# Altium schematic sheet Top.SchDoc
size 431 x 279 mm; Author: Shivam Sharma; SheetNumber: 1; SheetTotal: 14; SheetRevision: 1.0
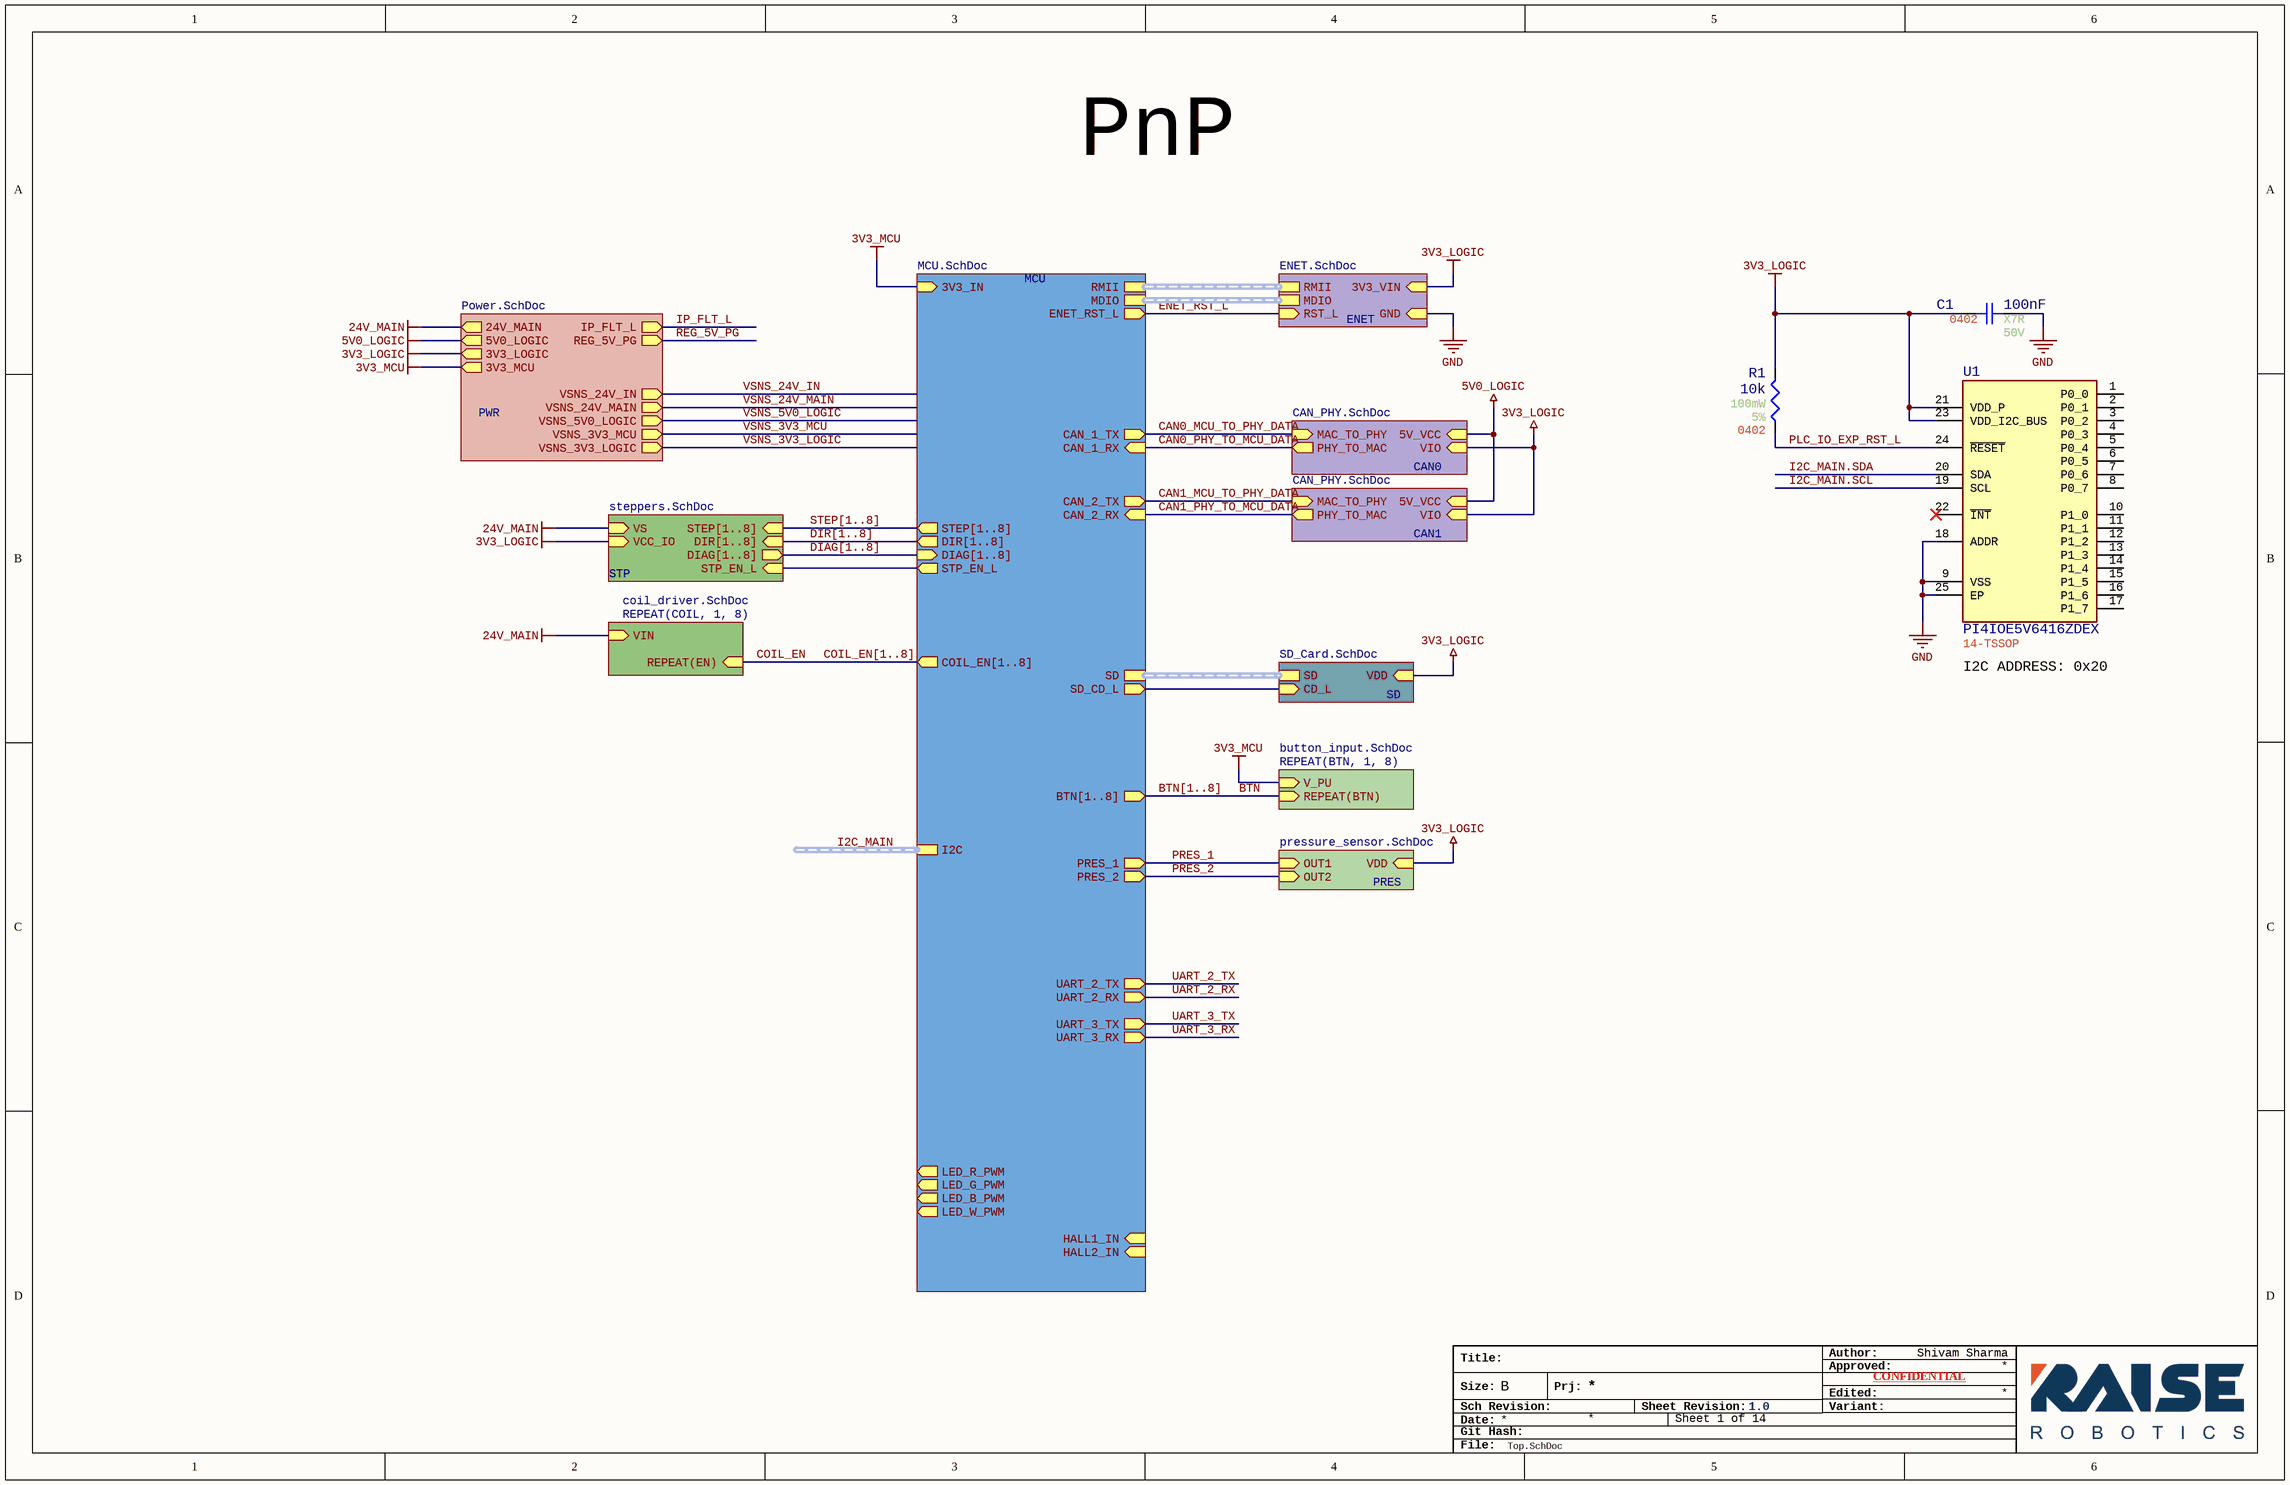
[diagram p0: Top.SchDoc]

## Parts
C1  value 100nF  Temperature Coefficient: X7R  Voltage Rating: 50V  Case/Package: 0402  [Generic 0402 capacitor]  (hidden comment: GRT155R71H104KE01D)
R1  value 10k  Power: 100mW  Tolerance: 5%  Case/Package: 0402  [Generic 0402 Resistor]  (hidden comment: ERJ-2GEJ103X)
U1  PI4IOE5V6416ZDEX  Case/Package: 14-TSSOP  [PI4IOE5V6416ZDEX]

## Sub-sheets
CAN0 = CAN_PHY.SchDoc: 5V_VCC (in), VIO (in), MAC_TO_PHY (in), PHY_TO_MAC (out)
CAN1 = CAN_PHY.SchDoc: 5V_VCC (in), VIO (in), MAC_TO_PHY (in), PHY_TO_MAC (out)
ENET = ENET.SchDoc: 3V3_VIN (in), GND (in), MDIO (harness MDIO), RMII (harness RMII), RST_L (in)
MCU = MCU.SchDoc: RMII (harness RMII), CAN_1_RX (in), CAN_1_TX (out), 3V3_IN (in), SD (harness SD), LED_R_PWM (out), LED_G_PWM (out), LED_B_PWM (out), LED_W_PWM (out), HALL2_IN (in), HALL1_IN (in), MDIO (harness MDIO), ENET_RST_L (out), SD_CD_L (out), UART_2_TX (out), UART_2_RX (out), UART_3_TX (out), UART_3_RX (out), CAN_2_RX (in), CAN_2_TX (out), STEP[1..8] (out), DIR[1..8] (out), DIAG[1..8] (in), STP_EN_L (out), I2C (harness I2C), COIL_EN[1..8] (out), BTN[1..8] (out), PRES_1 (out), PRES_2 (out)
PRES = pressure_sensor.SchDoc: VDD (in), OUT1 (in), OUT2 (in)
PWR = Power.SchDoc: IP_FLT_L (out), 24V_MAIN (out), 3V3_MCU (out), 3V3_LOGIC (out), 5V0_LOGIC (out), REG_5V_PG (out), VSNS_24V_IN (out), VSNS_24V_MAIN (out), VSNS_5V0_LOGIC (out), VSNS_3V3_MCU (out), VSNS_3V3_LOGIC (out)
REPEAT(BTN, 1, 8) = button_input.SchDoc: V_PU (in), REPEAT(BTN) (in)
REPEAT(COIL, 1, 8) = coil_driver.SchDoc: VIN (in), REPEAT(EN) (in)
SD = SD_Card.SchDoc: SD (harness SD), VDD (in), CD_L (in)
STP = steppers.SchDoc: STP_EN_L (in), DIAG[1..8] (out), VS (in), VCC_IO (in), STEP[1..8] (in), DIR[1..8] (in)

## Nets
3V3_LOGIC: C1.2 R1.2 U1.21(VDD_P) U1.23(VDD_I2C_BUS) ; sheet PWR/3V3_LOGIC, sheet CAN0/VIO, sheet CAN1/VIO, sheet ENET/3V3_VIN, sheet SD/VDD, sheet STP/VCC_IO, sheet PRES/VDD
3V3_MCU: sheet MCU/3V3_IN, sheet PWR/3V3_MCU, sheet REPEAT(BTN, 1, 8)/V_PU
5V0_LOGIC: sheet PWR/5V0_LOGIC, sheet CAN0/5V_VCC, sheet CAN1/5V_VCC
24V_MAIN: sheet PWR/24V_MAIN, sheet STP/VS, sheet REPEAT(COIL, 1, 8)/VIN
GND: C1.1 U1.9(VSS) U1.18(ADDR) U1.25(EP) ; sheet ENET/GND
BTN: sheet REPEAT(BTN, 1, 8)/REPEAT(BTN)
CAN0_MCU_TO_PHY_DATA: sheet MCU/CAN_1_TX, sheet CAN0/MAC_TO_PHY
CAN0_PHY_TO_MCU_DATA: sheet MCU/CAN_1_RX, sheet CAN0/PHY_TO_MAC
CAN1_MCU_TO_PHY_DATA: sheet MCU/CAN_2_TX, sheet CAN1/MAC_TO_PHY
CAN1_PHY_TO_MCU_DATA: sheet MCU/CAN_2_RX, sheet CAN1/PHY_TO_MAC
COIL_EN: sheet REPEAT(COIL, 1, 8)/REPEAT(EN)
ENET_RST_L: sheet MCU/ENET_RST_L, sheet ENET/RST_L
I2C_MAIN.SCL: U1.19(SCL)
I2C_MAIN.SDA: U1.20(SDA)
IP_FLT_L: sheet PWR/IP_FLT_L
PLC_IO_EXP_RST_L: R1.1 U1.24(~{RESET})
PRES_1: sheet MCU/PRES_1, sheet PRES/OUT1
PRES_2: sheet MCU/PRES_2, sheet PRES/OUT2
REG_5V_PG: sheet PWR/REG_5V_PG
UART_2_RX: sheet MCU/UART_2_RX
UART_2_TX: sheet MCU/UART_2_TX
UART_3_RX: sheet MCU/UART_3_RX
UART_3_TX: sheet MCU/UART_3_TX
VSNS_3V3_LOGIC: sheet PWR/VSNS_3V3_LOGIC
VSNS_3V3_MCU: sheet PWR/VSNS_3V3_MCU
VSNS_5V0_LOGIC: sheet PWR/VSNS_5V0_LOGIC
VSNS_24V_IN: sheet PWR/VSNS_24V_IN
VSNS_24V_MAIN: sheet PWR/VSNS_24V_MAIN
(unnamed): sheet MCU/SD_CD_L, sheet SD/CD_L
(unnamed): sheet MCU/STP_EN_L, sheet STP/STP_EN_L

Not connected (* = marked no-connect by the designer): U1 1(P0_0) 2(P0_1) 3(P0_2) 4(P0_3) 5(P0_4) 6(P0_5) 7(P0_6) 8(P0_7) 10(P1_0) 11(P1_1) 12(P1_2) 13(P1_3) 14(P1_4) 15(P1_5) 16(P1_6) 17(P1_7) 22(~{INT})*

## Buses and harness runs
bus BTN[1..8] = sheet MCU/BTN[1..8]
bus COIL_EN[1..8] = sheet MCU/COIL_EN[1..8]
bus DIAG[1..8] = sheet MCU/DIAG[1..8] = sheet STP/DIAG[1..8]
bus DIR[1..8] = sheet MCU/DIR[1..8] = sheet STP/DIR[1..8]
bus STEP[1..8] = sheet MCU/STEP[1..8] = sheet STP/STEP[1..8]
harness I2C_MAIN = sheet MCU/I2C
harness sheet ENET/MDIO = sheet MCU/MDIO
harness sheet ENET/RMII = sheet MCU/RMII
harness sheet MCU/SD = sheet SD/SD

## Notes on the sheet
- PnP
- (near U1) I2C ADDRESS: 0x20
- Title:
- Author:
- Approved:
- Size:
- Date:
- Git Hash:
- Sch Revision:
- B
- Prj:
- Sheet Revision:
- Variant:
- Edited:
- CONFIDENTIAL
- File:

## Library data of the parts
C1 = CMP-001-00084-12: Ceramic Capacitor, Multilayer, Ceramic, 50V, 10% +Tol, 10% -Tol, X7R, 15% TC, 0.1uF, Surface Mount, 0402; AECQ: Yes; Reach SVHC Compliant: Yes; Mounting Technology: Surface Mount; Termination: Wraparound; Pins: 2; Packaging: Tape and Reel; Package Shape: Rectangular; Multilayer: Yes; Tolerance: 10%; Max Operating Temperature: 125°C; Terminal Finish: Nickel; Capacitor Type: Ceramic; Dielectric Material: Ceramic; Min Operating Temperature: -55°C; RoHS Compliant: Yes
R1 = CMP-009-00185-9: Res Thick Film 0402 10K Ohm 5% 1/10W ±200ppm/°C Molded SMD Punched Carrier T/R; AECQ: No; Pins: 2; Max Operating Temperature: 155°C; RoHS Compliant: Yes; Min Operating Temperature: -55°C; Mounting Technology: Surface Mount
U1 = CMP-031-00013-2: 16-bit I2C General Purpose IO Expander with Interrupt, Reset, -40 to 85 °C, RoHS; Number of Circuits: 1; AECQ: No; Min Supply Voltage: 1.65V; Max Supply Voltage: 5.5V; Number of Terminals: 24; Schedule B: 8542390000, 8542390000; Pins: 14; RoHS: Compliant; Max Operating Temperature: 85°C; Lifecycle Status: Production; Terminal Pitch: 500µm; Width: 4mm; Min Operating Temperature: -40°C; REACH SVHC: Yes; Length: 4mm; Height - Seated (Max): 900µm; MPN: PI4IOE5V6416ZDEX